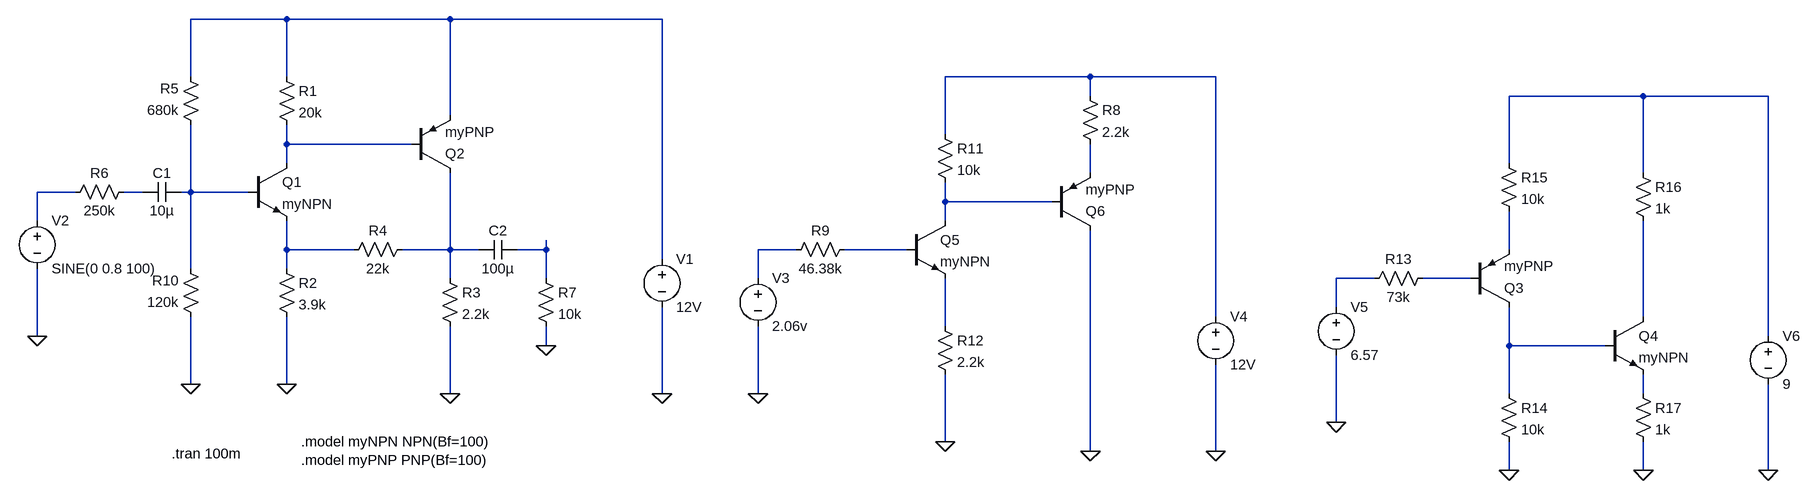
[diagram p0: schematic pnp_npn.asc]
pnp_npn.asc, the LTspice schematic file:
Version 4
SHEET 1 3852 868
WIRE 592 96 432 96
WIRE 864 96 592 96
WIRE 1344 96 864 96
WIRE 432 192 432 96
WIRE 592 192 592 96
WIRE 2128 192 1856 192
WIRE 2400 192 2128 192
WIRE 2128 224 2128 192
WIRE 3408 224 3184 224
WIRE 3776 224 3408 224
WIRE 864 256 864 96
WIRE 1856 288 1856 192
WIRE 592 304 592 272
WIRE 800 304 592 304
WIRE 592 336 592 304
WIRE 3184 336 3184 224
WIRE 2128 352 2128 304
WIRE 3408 352 3408 224
WIRE 240 384 176 384
WIRE 352 384 320 384
WIRE 432 384 432 272
WIRE 432 384 416 384
WIRE 528 384 432 384
WIRE 1856 400 1856 368
WIRE 2064 400 1856 400
WIRE 176 432 176 384
WIRE 1856 432 1856 400
WIRE 592 480 592 432
WIRE 704 480 592 480
WIRE 864 480 864 352
WIRE 864 480 784 480
WIRE 912 480 864 480
WIRE 1024 480 1024 464
WIRE 1024 480 976 480
WIRE 1568 480 1504 480
WIRE 1792 480 1648 480
WIRE 3184 480 3184 416
WIRE 1344 496 1344 96
WIRE 432 512 432 384
WIRE 592 512 592 480
WIRE 864 528 864 480
WIRE 1024 528 1024 480
WIRE 1504 528 1504 480
WIRE 2960 528 2896 528
WIRE 3120 528 3040 528
WIRE 2896 576 2896 528
WIRE 2400 592 2400 192
WIRE 3408 592 3408 432
WIRE 1856 608 1856 528
WIRE 176 624 176 512
WIRE 3776 624 3776 224
WIRE 1024 640 1024 608
WIRE 3184 640 3184 576
WIRE 3344 640 3184 640
WIRE 432 704 432 592
WIRE 592 704 592 592
WIRE 864 720 864 608
WIRE 1344 720 1344 576
WIRE 1504 720 1504 608
WIRE 3184 720 3184 640
WIRE 3408 720 3408 688
WIRE 2896 768 2896 656
WIRE 1856 800 1856 688
WIRE 2128 816 2128 448
WIRE 2400 816 2400 672
WIRE 3184 848 3184 800
WIRE 3408 848 3408 800
WIRE 3776 848 3776 704
FLAG 1504 720 0
FLAG 1344 720 0
FLAG 432 704 0
FLAG 592 704 0
FLAG 864 720 0
FLAG 2400 816 0
FLAG 1856 800 0
FLAG 2128 816 0
FLAG 176 624 0
FLAG 1024 640 0
FLAG 2896 768 0
FLAG 3776 848 0
FLAG 3184 848 0
FLAG 3408 848 0
SYMBOL res 1664 464 R90
WINDOW 0 0 56 VBottom 2
WINDOW 3 32 56 VTop 2
SYMATTR InstName R9
SYMATTR Value 46.38k
SYMBOL voltage 1504 512 R0
WINDOW 123 0 0 Left 2
WINDOW 39 0 0 Left 2
SYMATTR InstName V3
SYMATTR Value 2.06v
SYMBOL npn 528 336 R0
SYMATTR InstName Q1
SYMATTR Value myNPN
SYMBOL res 576 176 R0
SYMATTR InstName R1
SYMATTR Value 20k
SYMBOL res 576 496 R0
SYMATTR InstName R2
SYMATTR Value 3.9k
SYMBOL res 848 512 R0
SYMATTR InstName R3
SYMATTR Value 2.2k
SYMBOL res 800 464 R90
WINDOW 0 0 56 VBottom 2
WINDOW 3 32 56 VTop 2
SYMATTR InstName R4
SYMATTR Value 22k
SYMBOL res 448 288 R180
WINDOW 0 36 76 Left 2
WINDOW 3 36 40 Left 2
SYMATTR InstName R5
SYMATTR Value 680k
SYMBOL res 448 608 R180
WINDOW 0 36 76 Left 2
WINDOW 3 36 40 Left 2
SYMATTR InstName R10
SYMATTR Value 120k
SYMBOL pnp 800 352 M180
SYMATTR InstName Q2
SYMATTR Value myPNP
SYMBOL voltage 1344 480 R0
WINDOW 123 0 0 Left 2
WINDOW 39 0 0 Left 2
SYMATTR InstName V1
SYMATTR Value 12V
SYMBOL npn 1792 432 R0
SYMATTR InstName Q5
SYMATTR Value myNPN
SYMBOL res 1840 272 R0
SYMATTR InstName R11
SYMATTR Value 10k
SYMBOL res 1840 592 R0
SYMATTR InstName R12
SYMATTR Value 2.2k
SYMBOL pnp 2064 448 M180
SYMATTR InstName Q6
SYMATTR Value myPNP
SYMBOL voltage 2400 576 R0
WINDOW 123 0 0 Left 2
WINDOW 39 0 0 Left 2
SYMATTR InstName V4
SYMATTR Value 12V
SYMBOL res 336 368 R90
WINDOW 0 0 56 VBottom 2
WINDOW 3 32 56 VTop 2
SYMATTR InstName R6
SYMATTR Value 250k
SYMBOL voltage 176 416 R0
WINDOW 123 0 0 Left 2
WINDOW 39 0 0 Left 2
SYMATTR InstName V2
SYMATTR Value SINE(0 0.8 100)
SYMBOL cap 912 496 R270
WINDOW 0 32 32 VTop 2
WINDOW 3 0 32 VBottom 2
SYMATTR InstName C2
SYMATTR Value 100µ
SYMBOL res 1008 512 R0
SYMATTR InstName R7
SYMATTR Value 10k
SYMBOL cap 416 368 R90
WINDOW 0 0 32 VBottom 2
WINDOW 3 32 32 VTop 2
SYMATTR InstName C1
SYMATTR Value 10µ
SYMBOL res 2112 208 R0
SYMATTR InstName R8
SYMATTR Value 2.2k
SYMBOL res 3056 512 R90
WINDOW 0 0 56 VBottom 2
WINDOW 3 32 56 VTop 2
SYMATTR InstName R13
SYMATTR Value 73k
SYMBOL voltage 2896 560 R0
WINDOW 123 0 0 Left 2
WINDOW 39 0 0 Left 2
SYMATTR InstName V5
SYMATTR Value 6.57
SYMBOL pnp 3120 576 M180
SYMATTR InstName Q3
SYMATTR Value myPNP
SYMBOL npn 3344 592 R0
SYMATTR InstName Q4
SYMATTR Value myNPN
SYMBOL res 3168 704 R0
SYMATTR InstName R14
SYMATTR Value 10k
SYMBOL res 3168 320 R0
SYMATTR InstName R15
SYMATTR Value 10k
SYMBOL res 3392 336 R0
SYMATTR InstName R16
SYMATTR Value 1k
SYMBOL res 3392 704 R0
SYMATTR InstName R17
SYMATTR Value 1k
SYMBOL voltage 3776 608 R0
WINDOW 123 0 0 Left 2
WINDOW 39 0 0 Left 2
SYMATTR InstName V6
SYMATTR Value 9
TEXT 616 800 Left 2 !.model myNPN NPN(Bf=100)\n.model myPNP PNP(Bf=100)
TEXT 400 820 Left 2 !.tran 100m

The netlist it stands for:
* pnp_npn.asc
R9 N014 N013 46.38k
V3 N013 0 2.06v
Q1 N004 N008 N010 0 myNPN
R1 N001 N004 20k
R2 N010 0 3.9k
R3 N011 0 2.2k
R4 N011 N010 22k
R5 N008 N001 680k
R10 0 N008 120k
Q2 N011 N004 N001 0 myPNP
V1 N001 0 12V
Q5 N009 N014 N019 0 myNPN
R11 N002 N009 10k
R12 N019 0 2.2k
Q6 0 N009 N005 0 myPNP
V4 N002 0 12V
R6 N007 N006 250k
V2 N006 0 SINE(0 0.8 100)
C2 N011 N012 100µ
R7 N012 0 10k
C1 N008 N007 10µ
R8 N002 N005 2.2k
R13 N017 N016 73k
V5 N016 0 6.57
Q3 N020 N017 N015 0 myPNP
Q4 N018 N020 N021 0 myNPN
R14 N020 0 10k
R15 N003 N015 10k
R16 N003 N018 1k
R17 N021 0 1k
V6 N003 0 9
.model NPN NPN
.model PNP PNP
.lib standard.bjt
.model myNPN NPN(Bf=100)
.model myPNP PNP(Bf=100)
.tran 100m
.backanno
.end